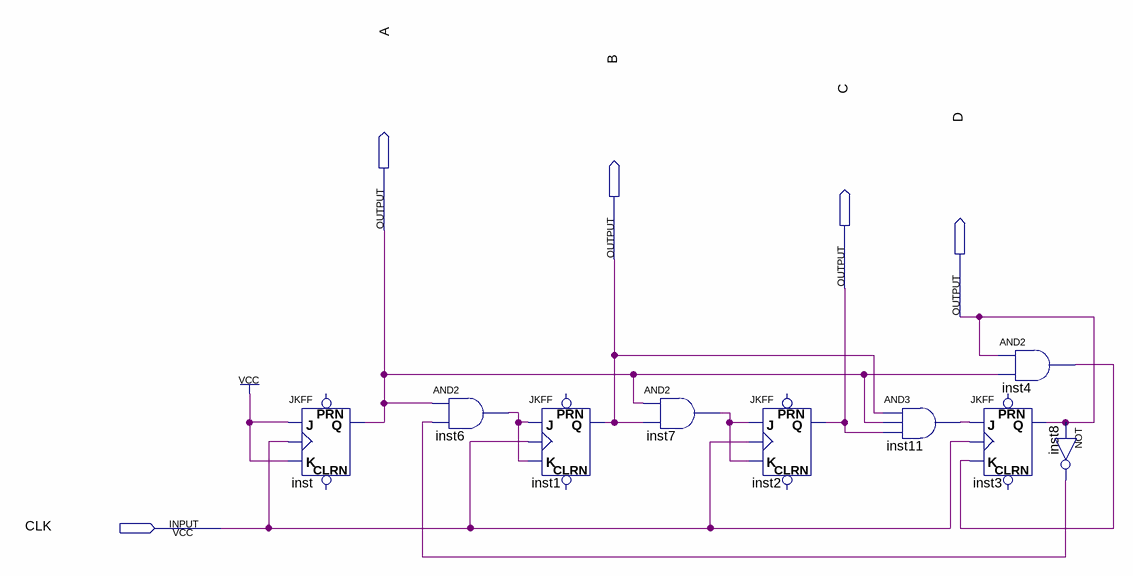
[diagram p0: schematic sheet]
// Quartus schematic decadic.bdf as structural Verilog: 9 symbols, 5 pins
module decadic (
  input  CLK,
  output A,
  output B,
  output C,
  output D
);

  wire inst4_out, inst6_out, inst7_out, inst8_out, inst11_out;

  JKFF inst (.K(1'b1), .J(1'b1), .CLK(CLK), .Q(A));  // open: PRN, CLRN
  and inst6 (inst6_out, A, inst8_out);
  JKFF inst1 (.K(inst6_out), .J(inst6_out), .CLK(CLK), .Q(B));  // open: PRN, CLRN
  and inst7 (inst7_out, A, B);
  JKFF inst2 (.K(inst7_out), .J(inst7_out), .CLK(CLK), .Q(C));  // open: PRN, CLRN
  and inst11 (inst11_out, B, A, C);
  and inst4 (inst4_out, D, A);
  JKFF inst3 (.K(inst4_out), .J(inst11_out), .CLK(CLK), .Q(D));  // open: PRN, CLRN
  not inst8 (inst8_out, D);
endmodule
